# Altium schematic sheet SOC nRF52832.SchDoc
size B
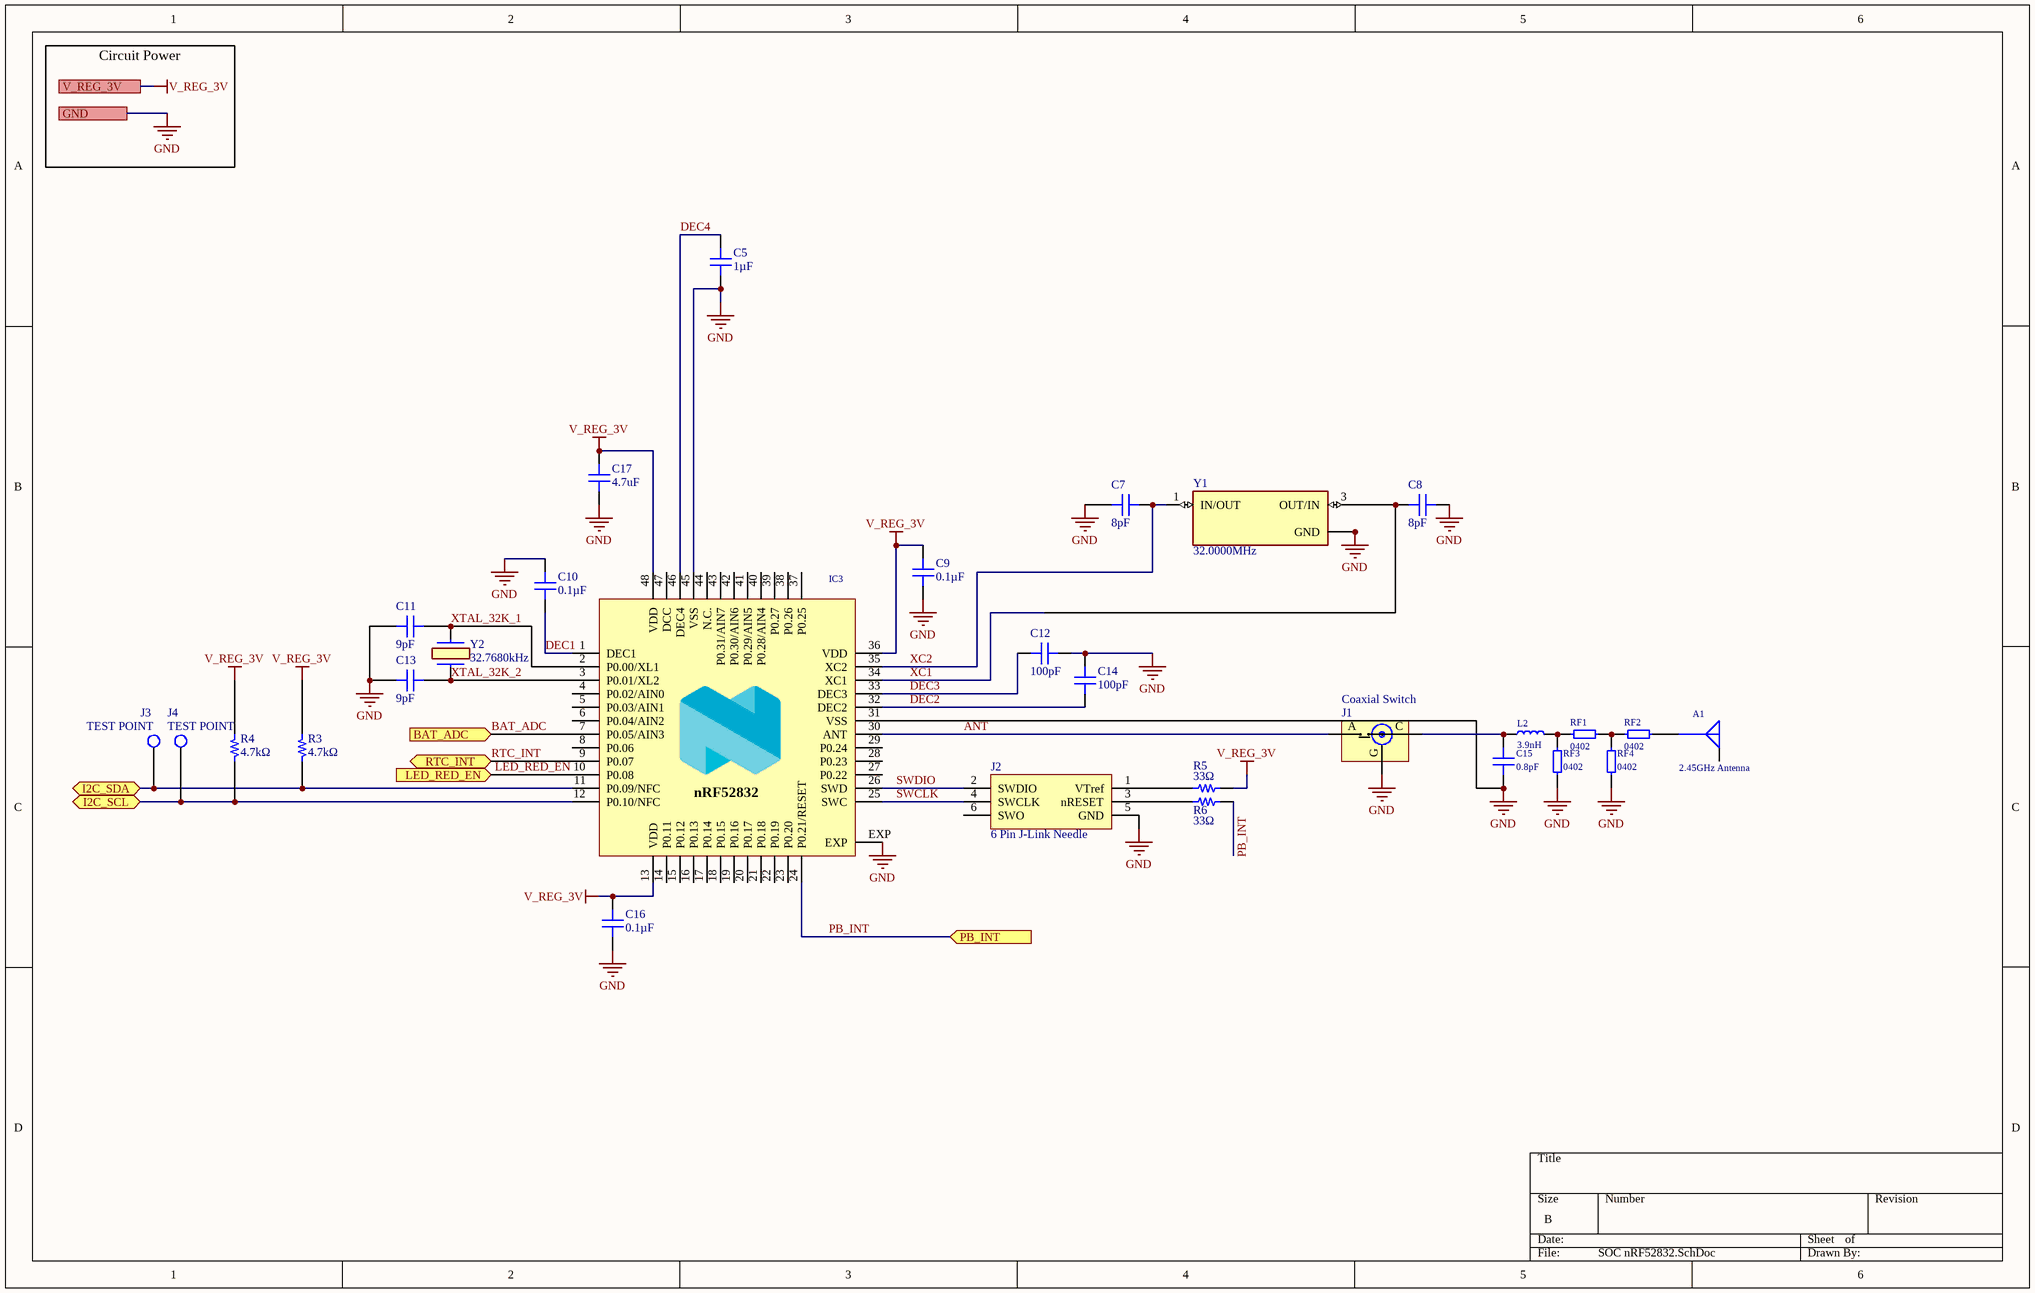
[diagram p0: SOC nRF52832.SchDoc]

## Parts
A1  2.45GHz Antenna  [FRACTUS ANTENNAS FR01-S1-N-0-102]
C5  1µF  [CAP 0402_1005 RF]
C7  8pF  [CAP 0402_1005]
C8  8pF  [CAP 0402_1005]
C9  0.1µF  [CAP 0402_1005]
C10  0.1µF  [CAP 0402_1005]
C11  9pF  [CAP 0402_1005]
C12  100pF  [CAP 0402_1005]
C13  9pF  [CAP 0402_1005]
C14  100pF  [CAP 0402_1005]
C15  0.8pF  [CAP 0603_1608]
C16  0.1µF  [CAP 0402_1005]
C17  4.7uF  [CAP 0402_1005]
IC3  RF SoC  [NORDIC QFN-48]  (value not drawn)
J1  Coaxial Switch  [HIROSE MS-156HF(01)]
J2  6 Pin J-Link Needle  [J-LINK 6-PIN NEEDLE]  (no BOM)
J3  TEST POINT  [TEST POINT]
J4  TEST POINT  [TEST POINT]
L2  3.9nH  [IND 0402_1005]
R3  4.7kΩ  [RES 0402_1005 RF]
R4  4.7kΩ  [RES 0402_1005 RF]
R5  33Ω  [RES 0201_0603]
R6  33Ω  [RES 0201_0603]
RF1  0402  [0402_1005 RF]  (no BOM)
RF2  0402  [0402_1005 RF]  (no BOM)
RF3  0402  [0402_1005 RF]  (no BOM)
RF4  0402  [0402_1005 RF]  (no BOM)
Y1  32.0000MHz  [ECS 320-8-37B]
Y2  32.7680kHz  [EPSON FC135R]

## Ports
BAT_ADC (in), GND, I2C_SCL (bidir), I2C_SDA (bidir), LED_RED_EN (in), PB_INT (in), RTC_INT (bidir), V_REG_3V

## Nets
GND: C5.1 C7.1 C8.2 C9.1 C10.2 C11.1 C12.2 C13.1 C14.2 C15.1 C16.1 C17.1 IC3.31(VSS) IC3.45(VSS) IC3.EXP J1.G J2.5(GND) RF3.1 RF4.1 Y1.2(GND) Y1.4(GND) ; port GND
V_REG_3V: C9.2 C16.2 C17.2 IC3.13(VDD) IC3.36(VDD) IC3.48(VDD) R3.2 R4.2 R5.2 ; port V_REG_3V
ANT: IC3.30(ANT) J1.A
BAT_ADC: IC3.7(P0.05/AIN3) ; port BAT_ADC
DEC1: C10.1 IC3.1(DEC1)
DEC2: C14.1 IC3.32(DEC2)
DEC3: C12.1 IC3.33(DEC3)
DEC4: C5.2 IC3.46(DEC4)
I2C_SCL: IC3.12(P0.10/NFC) J4.1(PAD) R4.1 ; port I2C_SCL
I2C_SDA: IC3.11(P0.09/NFC) J3.1(PAD) R3.1 ; port I2C_SDA
LED_RED_EN: IC3.10(P0.08) ; port LED_RED_EN
PB_INT: IC3.24(P0.21/RESET) R6.2 ; port PB_INT
RTC_INT: IC3.9(P0.07) ; port RTC_INT
SWCLK: IC3.25(SWC) J2.4(SWCLK)
SWDIO: IC3.26(SWD) J2.2(SWDIO)
XC1: C8.1 IC3.34(XC1) Y1.3(OUT/IN)
XC2: C7.2 IC3.35(XC2) Y1.1(IN/OUT)
XTAL_32K_1: C11.2 IC3.2(P0.00/XL1) Y2.1(CRYSTAL_1)
XTAL_32K_2: C13.2 IC3.3(P0.01/XL2) Y2.2(CRYSTAL_2)
NetA1_S: A1.S RF2.2
NetC15_2: C15.2 J1.C L2.1
NetJ2_1: J2.1(VTref) R5.1
NetJ2_3: J2.3(nRESET) R6.1
NetL2_2: L2.2 RF1.1 RF3.2
NetRF1_2: RF1.2 RF2.1 RF4.2

Not connected (* = marked no-connect by the designer): A1 G; IC3 4(P0.02/AIN0) 5(P0.03/AIN1) 6(P0.04/AIN2) 8(P0.06) 14(P0.11) 15(P0.12) 16(P0.13) 17(P0.14) 18(P0.15) 19(P0.16) 20(P0.17) 21(P0.18) 22(P0.19) 23(P0.20) 27(P0.22) 28(P0.23) 29(P0.24) 37(P0.25) 38(P0.26) 39(P0.27) 40(P0.28/AIN4) 41(P0.29/AIN5) 42(P0.30/AIN6) 43(P0.31/AIN7) 44(N.C.) 47(DCC); J2 6(SWO)

## Notes on the sheet
- Circuit Power
- (in symbol SOC00001) nRF52832

## Library data of the parts
A1 = ANT00000: COMPACT REACH XTEND - 102; Manufacturer: Ignion; Manufacturer P/N: NN01-102; RF Family/Standard: 802.15.4, Bluetooth, WiFi; Frequency Group: UHF (2GHz ~ 3GHz); Frequency Range: 2.4GHz ~ 2.5GHz; Antenna Type: Chip; VSWR: 2; Gain: 1.7dBi; Device ID: ANT00000; VALUE: 2.45GHz Antenna; Mounting Type: Surface Mount; Part Type: Chip; Operating Temperature: -40°C ~ 125°C; Package: 7mm; Frequency (Center/Band): 2.45GHz; Return Loss: -; Supplier1: Digi-Key; Supplier1 P/N: 2115-NN01-102CT-ND; Supplier2: Mouser; Supplier2 P/N: 128-NN01-102
C5 = CAP00027: CAP CER 1UF 10V X7S 0402; Manufacturer: Murata Electronics; Manufacturer P/N: GCM155C71A105ME38D; Tolerance: ±20%; Device ID: CAP00027; Mounting Type: Surface Mount; Part Type: Capacitor; VALUE: 1µF; Operating Temperature: -55°C ~ 125°C; Voltage: 10V; Package: 0402 (1005 Metric); Supplier1: Digi-Key; Supplier1 P/N: 490-18202-1-ND; Supplier2: Mouser; Supplier2 P/N: 81-GCM155C71A105ME8D; Temperature Coefficient: X7S
C7 C8 = CAP00054: CAP CER 8PF 50V NPO 0402; Manufacturer: Walsin; Manufacturer P/N: 0402N9R0B500CT; Tolerance: ±0.1%; Temperature Coefficient: C0G, NP0; Device ID: CAP00054; Mounting Type: Surface Mount; Part Type: Capacitor; VALUE: 8pF; Operating Temperature: -55°C ~ 125°C; Voltage: 50V; Package: 0402 (1005 Metric); Supplier1: Digi-Key; Supplier1 P/N: 1292-0402N9R0B500CTTR-ND; Supplier2: Mouser; Supplier2 P/N: 791-0402N9R0B500CT
C9 C10 C16 = CAP00001: CAP CER 0.1UF 16V X7R 0402; Manufacturer: KEMET; Manufacturer P/N: C0402C104K4RAC7411; Tolerance: ±10%; Device ID: CAP00001; Mounting Type: Surface Mount; Part Type: Capacitor; VALUE: 0.1µF; Operating Temperature: -55°C ~ 125°C; Voltage: 16V; Package: 0402 (1005 Metric); Supplier1: Digi-Key; Supplier1 P/N: 399-C0402C104K4RAC7411CT-ND; Supplier2: Mouser; Supplier2 P/N: 80-C0402C104K4R7411; Temperature Coefficient: X7R
C11 C13 = CAP0004E: CAP CER 9PF 50V NPO 0402; Manufacturer: Walsin; Manufacturer P/N: 0402N9R0B500CT; Tolerance: ±0.1%; Temperature Coefficient: C0G, NP0; Device ID: CAP0004E; Mounting Type: Surface Mount; Part Type: Capacitor; VALUE: 9pF; Operating Temperature: -55°C ~ 125°C; Voltage: 50V; Package: 0402 (1005 Metric); Supplier1: Digi-Key; Supplier1 P/N: 1292-0402N9R0B500CTTR-ND; Supplier2: Mouser; Supplier2 P/N: 791-0402N9R0B500CT
C12 C14 = CAP00000: CAP CER 100PF 16V C0G/NP0 0402; Manufacturer: KEMET; Manufacturer P/N: C0402C101K4GACTU; Tolerance: ±10%; Temperature Coefficient: C0G, NP0; Device ID: CAP00000; Mounting Type: Surface Mount; Part Type: Capacitor; VALUE: 100pF; Operating Temperature: -55°C ~ 125°C; Voltage: 16V; Package: 0402 (1005 Metric); Supplier1: Digi-Key; Supplier1 P/N: 399-7749-1-ND; Supplier2: Mouser; Supplier2 P/N: 80-C0402C101K4G
C15 = CAP0004D: CAP CER 0.8PF 50V NP0  0603; Manufacturer: Walsin; Manufacturer P/N: 0603N0R8C500CT; Tolerance: ±0.25pF; Temperature Coefficient: C0G, NP0; Device ID: CAP0004D; Mounting Type: Surface Mount; Part Type: Capacitor; VALUE: 0.8pF; Operating Temperature: -55°C ~ 125°C; Voltage: 50V; Package: 0603 (1608 Metric); Supplier2: Mouser; Supplier2 P/N: 791-0603N0R8C500CT
C17 = CAP00055: CAP CER 8PF 50V NPO 0402; Manufacturer: Samsung Electro-Mechanics; Manufacturer P/N: CL05A475KQ5NRNC; Voltage: 10V; Tolerance: ±10%; Temperature Coefficient: X5R; Device ID: CAP00055; Mounting Type: Surface Mount; Part Type: Capacitor; VALUE: 4.7uF; Operating Temperature: -55°C ~ 125°C; Package: 0402 (1005 Metric); Supplier1: Digi-Key; Supplier1 P/N: 187-CL05A475KQ5NRNC; Supplier2: Mouser; Supplier2 P/N: 187-CL05A475KQ5NRNC
IC3 = SOC00001: IC RF TXRX+MCU BLUETOOTH 48VFQFN; Manufacturer: Nordic Semiconductor; Manufacturer P/N: nRF52832-QFAA-R; Current - Transmitting: 5.5mA ~ 15.2mA; Voltage Supply: 1.7V ~ 3.6V; Sensitivity: -96dBm; Power Output: 4dBm; Frequency: 2.4GHz; Data Rate (Max): 2Mbps; Current - Receiving: 5.5mA ~ 10.4mA; GPIO: 32; Memory Size: 512kB Flash, 64kB RAM; Device ID: SOC00001; Part Type: IC; VALUE: RF SoC; Operating Temperature: -40°C ~ 85°C; Package: QFN-48; Supplier1: Digi-Key; Supplier1 P/N: 1490-1052-1-ND; Supplier2: Digi-Key; Supplier2 P/N: 1490-1067-1-ND; Mounting Type: Surface Mount; Supplier3: Mouser; Supplier3 P/N: 949-NRF52832-QFAA-R7
J1 = RFC00001: CONN COAX SWITCH RCPT STR 50OHM; Manufacturer: Hirose Electric Co Ltd; Manufacturer P/N: MS-156HF(01); Connector Type: Receptacle, Female Socket; Contact Termination: Solder; Impedance: 50Ω; Mating Cycles: 100; Frequency - Max: 6GHz; Device ID: RFC00001; VALUE: Coaxial Switch; Mounting Type: Surface Mount; Part Type: RF Connector; Operating Temperature: -40°C ~ 85°C; Package: Coaxial Switch; Connector Style: MS-156HF(01); Shield Termination: Solder; Cable Group: -; Fastening Type: Snap-On; Supplier1: Digi-Key; Supplier1 P/N: H11669-ND; Supplier2: Mouser; Supplier2 P/N: 798-MS156HF01
J2 = J-LINK 6-PIN NEEDLE ADAPTER: Device ID: CON00004; Connector Type: Board; Style: On-Board; Number of Positions: 6; Number of Positions Loaded: All; Pitch - Mating: 0.050" (1.27mm); VALUE: 6 Pin J-Link Needle; Mounting Type: Board Connector; Part Type: Header; Manufacturer: -; Manufacturer P/N: -; Operating Temperature: -; Package: N/A; Contact Type: Pogo-Pins; Fastening Type: -; Contact Finish - Mating: -; Insulation Color: -; Material Flammability Rating: -; Current Rating (Amps): -; Voltage Rating: -; Supplier1: -; Supplier1 P/N: -; Supplier2: -; Supplier2 P/N: --
J3 J4 = -: Device ID: CON00015; Connector Type: Pad; Number of Positions: 1; Number of Positions Loaded: All; VALUE: Test Point; Mounting Type: Surface Mount; Part Type: Header; Manufacturer: -; Manufacturer P/N: -; Operating Temperature: -; Package: -; Contact Type: Pad; Style: Pad; Pitch - Mating: -; Fastening Type: -; Contact Finish - Mating: Gold; Insulation Color: -; Material Flammability Rating: -; Current Rating (Amps): -; Voltage Rating: -; Supplier1: -; Supplier1 P/N: -; Supplier2: -; Supplier2 P/N: -
L2 = IND00004: FIXED IND 3.9NH 250MA 450MOHM SM; Manufacturer: KYOCERA AVX; Manufacturer P/N: L04023R9BHNTR; Tolerance: ±0.1%; DC Resistance: 0.460Ω; Q @ Freq: 13 @ 450MHz; Material - Core: Non-Magnetic; Frequency - Self Resonant: 8GHz; Device ID: IND00004; Part Type: Inductor; VALUE: 3.9nH; Operating Temperature: -55°C ~ 125°C; Current Saturation: -; Package: 0402 (1005 Metric); Supplier1: Digi-Key; Supplier1 P/N: 478-4199-2-ND; Supplier2: Mouser; Supplier2 P/N: 581-L04023R9BHNTR; Mounting Type: Surface Mount
R3 R4 = RES0003B: RES SMD 4.7K OHM 1% 1/8W 0402; Manufacturer: YAGEO; Manufacturer P/N: AC0402FR-7W4K7L; Power: 0.125W; Device ID: RES0003B; VALUE: 4.7kΩ; Mounting Type: Surface Mount; Part Type: Resistor; Operating Temperature: -55°C ~ 155°C; Package: 0402 (1005 Metric); Tolerance: ±1%; Composition: Thick Film; Supplier1: Digi-Key; Supplier1 P/N: 603-AC0402FR-7W4K7L; Supplier2: Mouser; Supplier2 P/N: 603-AC0402FR-7W4K7L
R5 R6 = RES0003A: RES SMD 33 OHM 1% 1/20W 0201; Manufacturer: Vishay Dale; Manufacturer P/N: CRCW020110R0FNED; Power: 0.050W; Device ID: RES0003A; VALUE: 33Ω; Mounting Type: Surface Mount; Part Type: Resistor; Operating Temperature: -55°C ~ 155°C; Package: 0201 (0603 Metric); Tolerance: ±1%; Composition: Thick Film; Supplier1: Digi-Key; Supplier1 P/N: 541-10.0ABCT-ND; Supplier2: Mouser; Supplier2 P/N: 71-CRCW020110R0FNED
RF1-RF4 = RFP00000: 0402 RF Passive; Device ID: RFP00000; VALUE: 0402; Mounting Type: Surface Mount; Part Type: Passive
Y1 = XTL00005: CRYSTAL 32.0000MHZ 8PF SMD; Manufacturer: ECS; Manufacturer P/N: ECS-320-8-37B-7KM-TR3; Tolerance: ±7ppm; Operating Mode: Fundamental; ESR: 50Ω; Device ID: XTL00005; Part Type: XTAL; VALUE: 32.0000MHz; Operating Temperature: -20°C ~ 70°C; Load Capacitance: 8pF; Package: 4-SMD, No Lead; Supplier1: Digi-Key; Supplier1 P/N: 50-ECS-320-8-37B-7KM-TR3TR-ND; Supplier2: Mouser; Supplier2 P/N: 520-ECS320837B7KMTR3 / 729-G43270021; Mounting Type: Surface Mount
Y2 = XTL00004: CRYSTAL 32.7680KHZ 9PF SMD; Manufacturer: EPSON; Manufacturer P/N: FC-135R 32.7680KF-AC3; Tolerance: ±10ppm; Operating Mode: Fundamental; ESR: 50kΩ; Device ID: XTL00004; Part Type: XTAL; VALUE: 32.7680kHz; Operating Temperature: -20°C ~ 70°C; Load Capacitance: 9pF; Package: 2-SMD, No Lead; Supplier1: Digi-Key; Supplier1 P/N: SER4075TR-ND; Supplier2: Mouser; Supplier2 P/N: 732-5R32.7680KF-AC3 / 729-G43270021; Mounting Type: Surface Mount